# EAGLE design atmel-ice-swd-adapter (EAGLE 9.4.1)
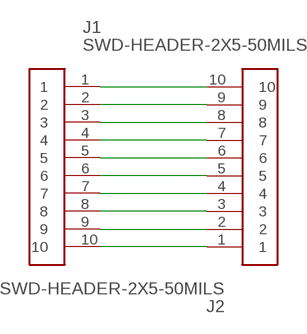
[diagram p0: schematic, sheet 1]

## Parts
J1  SWD-HEADER-2X5-50MILS  [HEADER-2X5-50MIL]
J2  SWD-HEADER-2X5-50MILS  [HEADER-2X5-50MIL]

## Nets
N$1: J1.1 J2.10
N$2: J1.2 J2.9
N$3: J1.3 J2.8
N$4: J1.4 J2.7
N$5: J1.5 J2.6
N$6: J1.6 J2.5
N$7: J1.7 J2.4
N$8: J1.8 J2.3
N$9: J1.9 J2.2
N$10: J1.10 J2.1

## Library data of the parts
J1 J2 = yapo:SWD-HEADER-2X5-50MILS

## Board
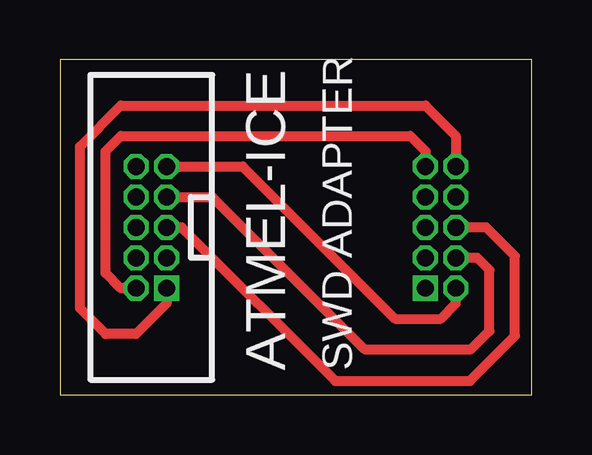
[diagram p1: board, top side]
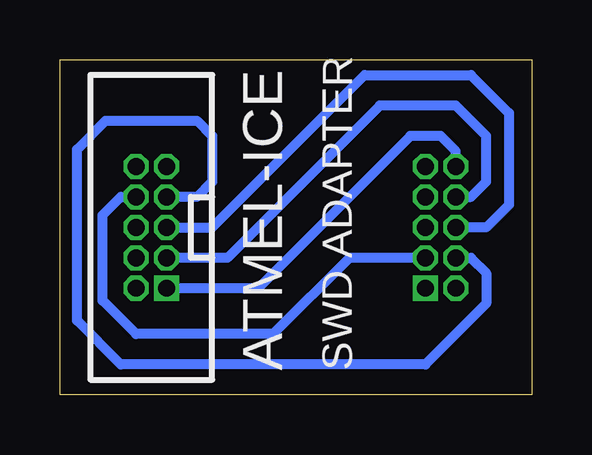
[diagram p2: board, bottom side, seen from below]

Size 19.68 x 13.97 mm. Coordinates in mm from the lower left corner, seen from the top.
Outline: 0,0 19.68,0 19.68,13.97 0,13.97 0,0
Copper layers (1*16): Top 0.035559375mm / dielectric 1.6mm / Bottom 0.035559375mm
Design rules "oshpark-2layer": minimum track width 6mil, minimum drill 10mil, track to track 6mil, track to pad 6mil, pad to pad 6mil, via to via 6mil, smd to smd 6mil, copper to edge 15mil, drill to drill 6mil, minimum pad ring 5mil, minimum via ring 5mil, stop-mask expansion 2.5mil, vias tented up to drill 0mil, thermal gap 10mil

### Footprints (pad centres in the part's own frame; a part is rotated, then mirrored left to right if it is on the bottom)
HEADER-2X5-50MIL = drill 0.7 pad 1.016 square: 1 -2.54,-0.635 | drill 0.7 pad 1.016 octagon: 2 -2.54,0.635; 3 -1.27,-0.635; 4 -1.27,0.635; 5 0,-0.635; 6 0,0.635; 7 1.27,-0.635; 8 1.27,0.635; 9 2.54,-0.635; 10 2.54,0.635

### Placement (x,y rotation side)
J1  15.88,6.99 90 bottom
J2  3.81,6.99 90 top

### Tracks (layer width: path | path; a pad name or v marks a point on that pad's centre or on a via)
N$1
  Bottom 0.406: J2.10 3.17,10.16 3.81,10.79 5.08,10.79 11.43,4.45 J1.1
N$2
  Top 0.406: J2.9 7.62,9.53 13.97,3.17 15.88,3.17 16.51,3.81 J1.2
N$3
  Bottom 0.406: J2.8 2.54,8.26 1.91,8.89 1.91,10.79 3.17,12.06 6.35,12.06 12.7,5.71 J1.3
N$4
  Top 0.406: J2.7 6.35,8.26 12.7,1.91 17.14,1.91 17.91,2.67 17.91,5.21 17.4,5.71 J1.4
N$5
  Bottom 0.406: J1.5 13.34,6.99 6.99,13.34 2.54,13.34 0.96,11.76 0.96,7.92 1.91,6.99 J2.6
N$6
  Top 0.406: J2.5 5.08,6.99 11.48,0.58 17.09,0.58 18.97,2.46 18.97,5.79 17.78,6.99 J1.6
N$7
  Bottom 0.406: J2.4 2.54,5.71 1.91,5.08 1.91,3.81 4.45,1.27 17.14,1.27 18.97,3.1 18.97,10.24 17.78,11.43 13.97,11.43 13.34,10.79 13.34,8.89 13.97,8.26 J1.7
N$8
  Bottom 0.406: J1.8 17.14,8.26 17.91,7.49 17.91,3.94 16.51,2.54 10.79,2.54 7.62,5.71 J2.3
N$9
  Top 0.406: J2.2 2.54,4.45 1.91,5.08 1.91,10.16 2.54,10.79 14.61,10.79 15.24,10.16 J1.9
N$10
  Top 0.406: J2.1 4.45,3.81 3.17,2.54 1.91,2.54 0.84,3.61 0.84,10.36 2.54,12.06 15.24,12.06 16.51,10.79 J1.10

### Text on the board
tPlace: ATMEL-ICE | SWD ADAPTER
bPlace: SWD ADAPTER | ATMEL-ICE